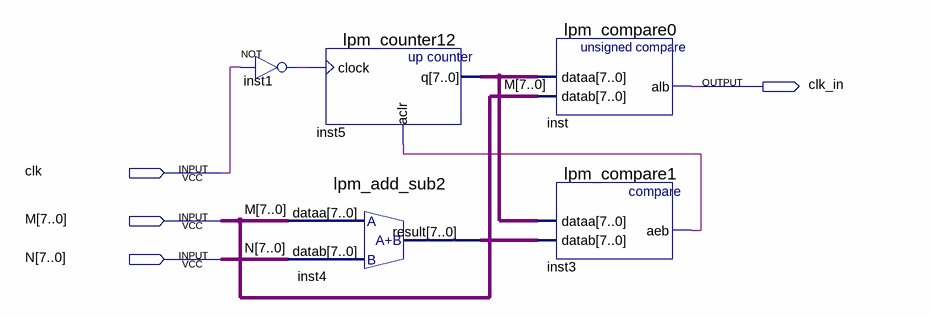
[diagram p0: schematic sheet]
// Quartus schematic Block1Dop.bdf as structural Verilog: 5 symbols, 4 pins
module Block1Dop (
  input  clk,
  input  [7:0] M,
  input  [7:0] N,
  output clk_in
);

  wire inst1_out, inst3_aeb;
  wire [7:0] inst4_result, inst5_q;

  not inst1 (inst1_out, clk);
  lpm_counter12 inst5 (.clock(inst1_out), .aclr(inst3_aeb), .q(inst5_q));
  lpm_add_sub2 inst4 (.dataa(M), .datab(N), .result(inst4_result));
  lpm_compare0 inst (.dataa(inst5_q), .datab(M), .alb(clk_in));
  lpm_compare1 inst3 (.dataa(inst5_q), .datab(inst4_result), .aeb(inst3_aeb));
endmodule
